# EAGLE design v_regulator (EAGLE 7.6.0)
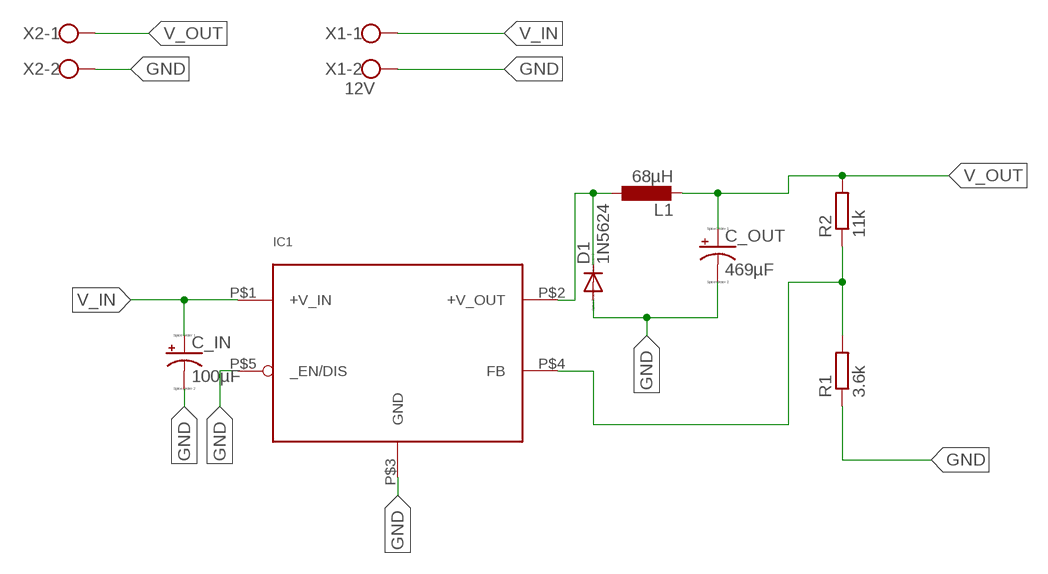
[diagram p0: schematic, sheet 1]

## Parts
C_IN  100µF  CPOL-USE2.5-5  [E2,5-5]
C_OUT  469µF  CPOL-USE2.5-5  [E2,5-5]
D1  1N5624  [DO201-15]
IC1  LM2576-T05D  [TO220-5_STAGGERED]
L1  68µH  L-EU6000-XXX-RC  [6000-XXXX-RC]
R1  3.6k  R-EU_0207/10  [0207/10]
R2  11k  R-EU_0207/10  [0207/10]
X1  12V  W237-102  [W237-102]
X2  W237-102  [W237-102]

## Nets
GND: C_IN.- C_OUT.- D1.A IC1.P$3(GND) IC1.P$5(_EN/DIS) R1.1 X1.2 X2.2
N$3: D1.C IC1.P$2(+V_OUT) L1.1
N$4: IC1.P$4(FB) R1.2 R2.1
V_IN: C_IN.+ IC1.P$1(+V_IN) X1.1
V_OUT: C_OUT.+ L1.2 R2.2 X2.1

## Library data of the parts
C_IN C_OUT = resistor:CPOL-US: POLARIZED CAPACITOR, American symbol
D1 = diode:1N5624: DIODE controlled avalanche rectifier
IC1 = LM2576:LM2576-T05D: LM2576/LM2576HV Series SIMPLE SWITCHER® 3A Step-Down Voltage Regulator STAGGERED PACKAGE
L1 = rcl:L-EU: INDUCTOR, European symbol
R1 R2 = resistor:R-EU_: RESISTOR, European symbol
X1 X2 = con-wago-500:W237-102: WAGO SCREW CLAMP; MPN: 237-102; OC_FARNELL: unknown; OC_NEWARK: 70K9898

## Board
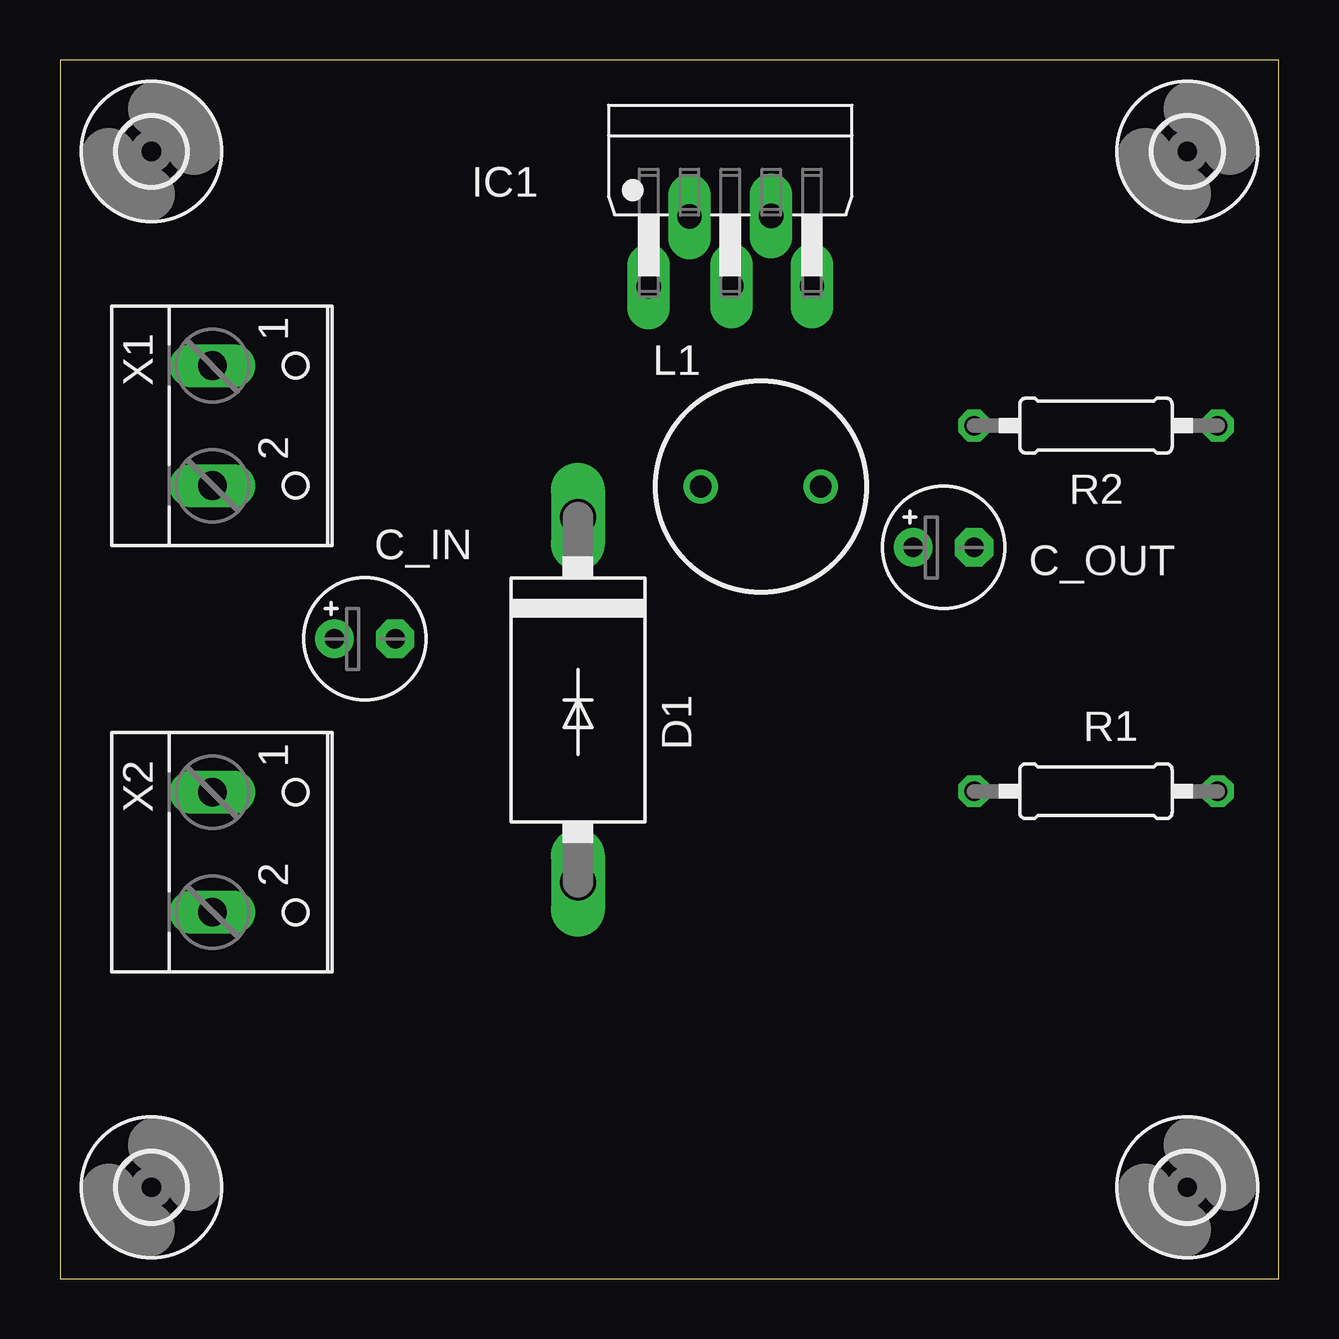
[diagram p1: board, top side]
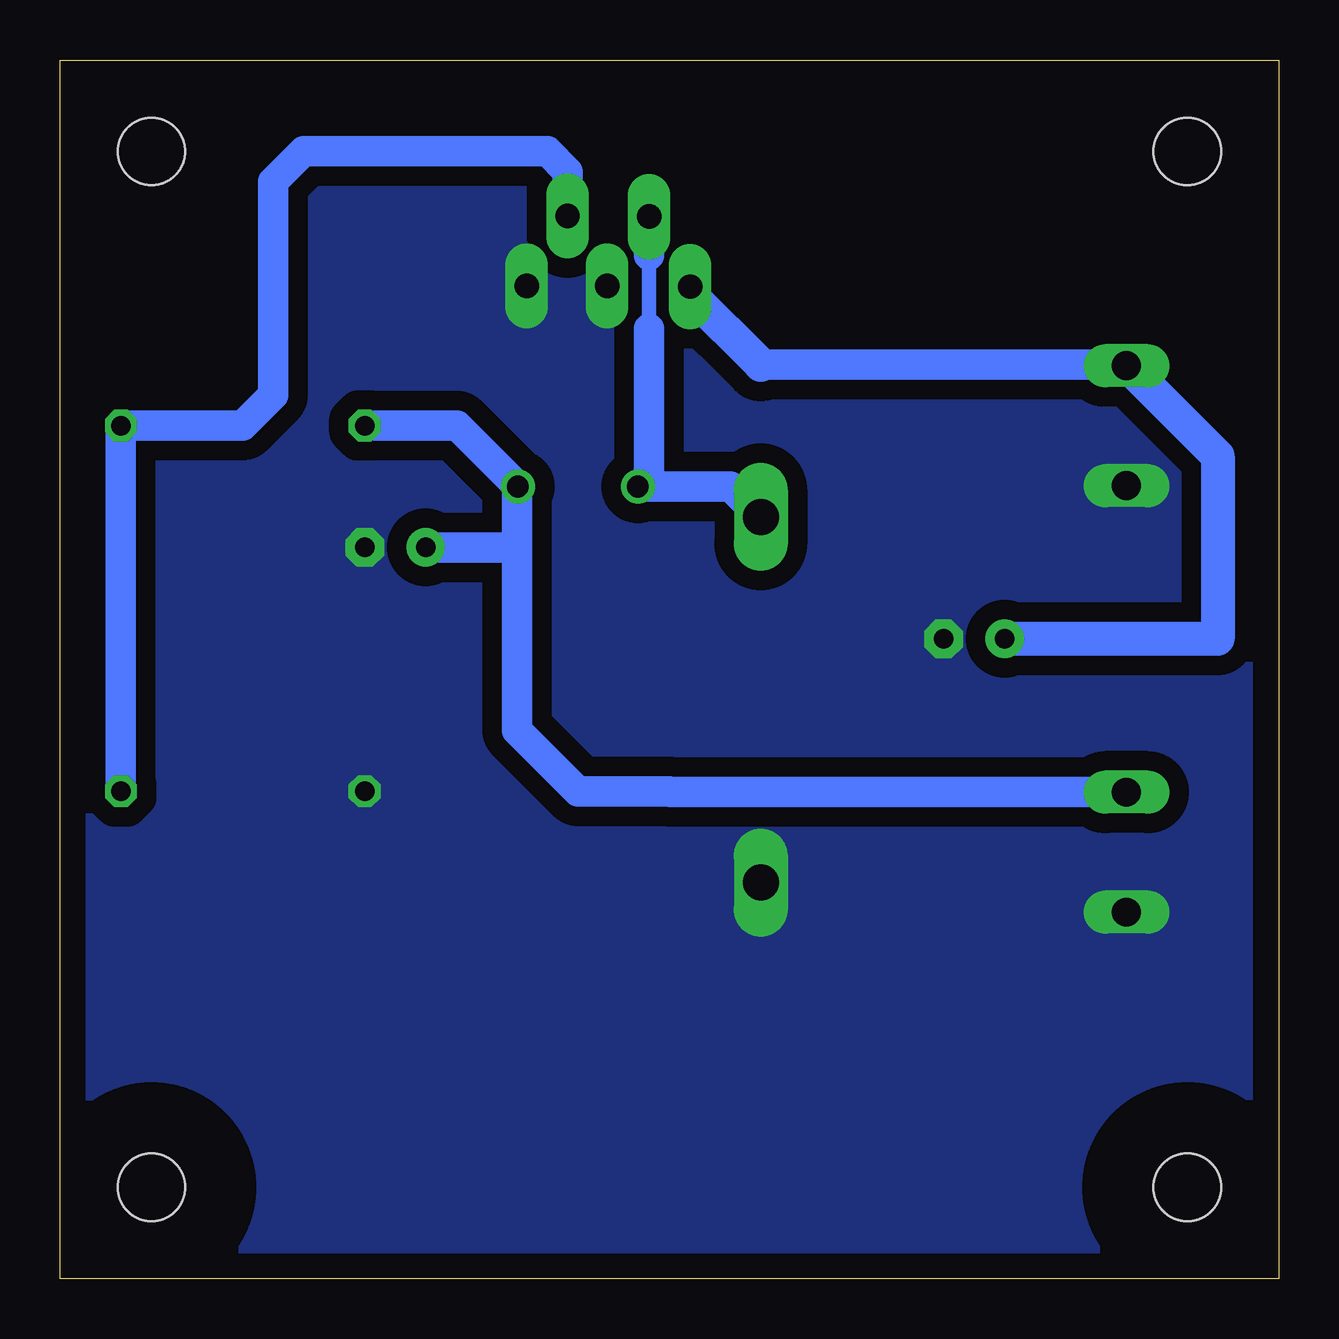
[diagram p2: board, bottom side, seen from below]

Size 50.8 x 50.8 mm. Coordinates in mm from the lower left corner, seen from the top.
Outline: 0,0 50.8,0 50.8,50.8 0,50.8 0,0
Copper layers (1*16): Top 0.035mm / dielectric 1.5mm / Bottom 0.035mm
Design rules "default": minimum track width 10mil, minimum drill 24mil, track to track 8mil, track to pad 8mil, pad to pad 8mil, via to via 8mil, smd to smd 8mil, copper to edge 40mil, drill to drill 8mil, minimum pad ring 10mil, minimum via ring 8mil, stop-mask expansion 4mil, vias tented up to drill 0mil, thermal gap 10mil

### Footprints (pad centres in the part's own frame; a part is rotated, then mirrored left to right if it is on the bottom)
E2,5-5 = drill 0.813 pad 1.6: + -1.27,0 | drill 0.813 pad 1.6 octagon: - 1.27,0
DO201-15 = drill 1.499 long: A 7.62,0; C -7.62,0
TO220-5_STAGGERED = drill 1.016 pad 1.778 long: P$1 -3.404,-3.099; P$2 -1.702,-0.178; P$3 0.051,-3.073; P$4 1.702,-0.152; P$5 3.404,-3.073
6000-XXXX-RC = drill 0.9 pad 1.422: 1 -2.5,0; 2 2.5,0
0207/10 = drill 0.813 octagon: 1 -5.08,0; 2 5.08,0
2,8 = hole 2.8: 0,0
W237-102 = drill 1.194 long: 1 -2.5,-1.27; 2 2.5,-1.27

### Placement (x,y rotation side)
C_IN  12.7,26.67 0 top
C_OUT  36.83,30.48 0 top
D1  21.59,24.13 270 top
IC1  27.94,44.45 0 top
L1  29.21,33.02 0 top
R1  43.18,20.32 0 top
R2  43.18,35.56 180 top
U$1  [2,8]  3.81,46.99 0 top
U$2  [2,8]  46.99,46.99 0 top
U$3  [2,8]  46.99,3.81 0 top
U$4  [2,8]  3.81,3.81 0 top
X1  7.62,35.56 270 top
X2  7.62,17.78 270 top

### Tracks (layer width: path | path; a pad name or v marks a point on that pad's centre or on a via)
GND
  pour Bottom (isolate 0.813, no thermals): 1.27,49.53 49.53,49.53 49.53,1.27 1.27,1.27
N$3
  Bottom 0.406: 26.24,33.49 L1.1
  Bottom 0.61: 26.24,42.67 26.24,39.6
  Bottom 1.27: D1.C 22.86,33.02 26.19,33.02 | 26.19,33.02 L1.1 | IC1.P$2 26.24,42.67 | 26.24,39.6 26.24,33.07 26.19,33.02
N$4
  Bottom 1.27: IC1.P$4 29.64,46.15 30.48,46.99 40.64,46.99 41.91,45.72 41.91,36.83 43.18,35.56 R2.1 R1.2
V_IN
  Bottom 1.27: 21.59,38.1 6.39,38.1
  Bottom 1.422: 6.35,38.1 X1.1 6.39,38.1 6.35,38.1 | IC1.P$1 24.54,41.05 21.59,38.1 | 6.35,38.1 2.54,34.29 2.54,26.67 C_IN.+
V_OUT
  Bottom 1.27: X2.1 25.36,20.28 25.4,20.32 29.21,20.32 31.75,22.86 31.75,30.48 | 31.75,30.48 31.75,32.98 L1.2 34.25,35.56 R2.2 | C_OUT.+ 31.75,30.48